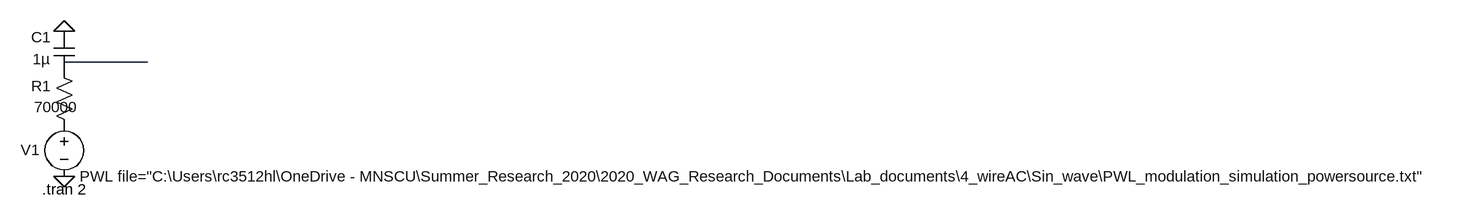
[diagram p0: schematic PWMmodulationSINEwave_Simulation.asc]
PWMmodulationSINEwave_Simulation.asc, the LTspice schematic file:
Version 4
SHEET 1 2400 680
WIRE 208 32 80 32
FLAG 80 208 0
FLAG 80 -16 0
SYMBOL voltage 80 112 R0
WINDOW 0 -67 55 Left 2
WINDOW 123 0 0 Left 0
WINDOW 39 0 0 Left 0
SYMATTR InstName V1
SYMATTR Value PWL file="C:\Users\rc3512hl\OneDrive - MNSCU\Summer_Research_2020\2020_WAG_Research_Documents\Lab_documents\4_wireAC\Sin_wave\PWL_modulation_simulation_powersource.txt"
SYMBOL res 64 32 R0
WINDOW 0 -35 37 Left 2
WINDOW 3 -30 69 Left 2
SYMATTR InstName R1
SYMATTR Value 70000
SYMBOL cap 64 -16 R0
WINDOW 0 -35 9 Left 2
WINDOW 3 -33 43 Left 2
SYMATTR InstName C1
SYMATTR Value 1µ
TEXT 46 228 Left 2 !.tran 2

The netlist it stands for:
* PWMmodulationSINEwave_Simulation.asc
V1 P001 0 PWL file="C:\Users\rc3512hl\OneDrive - MNSCU\Summer_Research_2020\2020_WAG_Research_Documents\Lab_documents\4_wireAC\Sin_wave\PWL_modulation_simulation_powersource.txt"
R1 P002 P001 70000
C1 0 P002 1µ
.tran 2
.backanno
.end

* Results of the author's LTspice run, read from the files saved beside the schematic
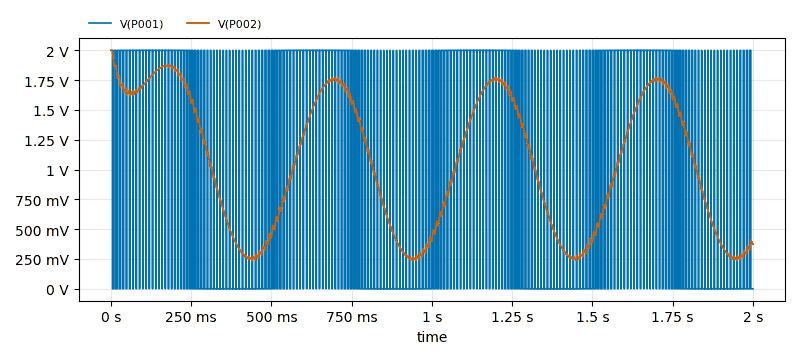
[diagram p1: Transient Analysis of PWMmodulationSINEwave_Simulation.asc, plotted from the saved traces]
* Transient Analysis, 1 run:
*   V(P001): min 0 V, max 2 V, average 1.001 V, rms 1.415 V, last 0 V
*   V(P002): min 236.5 mV, max 2 V, average 1.058 V, rms 1.199 V, last 373.5 mV